# EAGLE design eeZee555 (EAGLE 6.4)
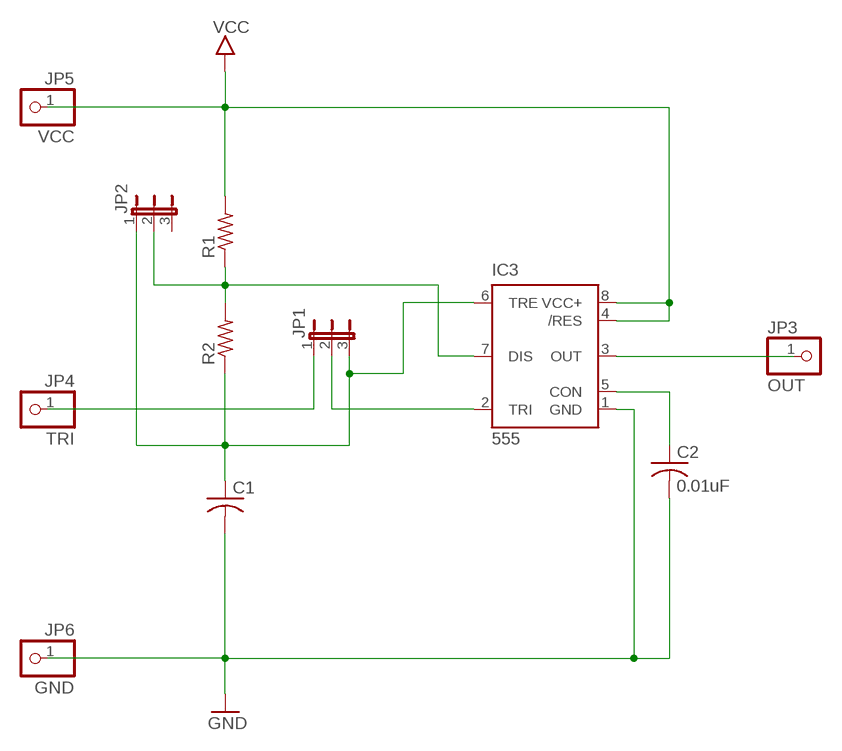
[diagram p0: schematic, sheet 1]

## Parts
C1  C-US050-025X075  [C050-025X075]
C2  0.01uF  C-USC0603  [C0603]
IC3  555  NE555P  [DIL-08]
JP1  JP2E  [JP2]
JP2  JP2E  [JP2]
JP3  OUT  PINHD-1X01_2.54-S  [1X01-S]
JP4  TRI  PINHD-1X01_2.54-S  [1X01-S]
JP5  VCC  PINHD-1X01_2.54-S  [1X01-S]
JP6  GND  PINHD-1X01_2.54-S  [1X01-S]
R1  R-US_0204/5  [0204/5]
R2  R-US_0204/5  [0204/5]

## Nets
GND: C1.2 C2.2 IC3.1(GND) JP6.1
N$15: IC3.7(DIS) JP2.2 R1.1 R2.2
N$16: C1.1 IC3.6(TRE) JP1.3 JP2.1 R2.1
N$17: JP1.1 JP4.1
N$18: IC3.2(TRI) JP1.2
N$19: IC3.3(OUT) JP3.1
N$20: C2.1 IC3.5(CON)
VCC: IC3.4(/RES) IC3.8(VCC+) JP5.1 R1.2
Unconnected: JP2.3

## Library data of the parts
C1 C2 = rcl:C-US: CAPACITOR, American symbol
IC3 = SparkFun:NE555: General purpose bipolar Timer; MF: Arrow Electronics; MPN: NE555N; OC_FARNELL: 1467742; OC_NEWARK: 89K1486
JP1 JP2 = jumper:JP2E: JUMPER
JP3-JP6 = pinhead-2:PINHD-1X01: PIN HEADER
R1 R2 = rcl:R-US_: RESISTOR, American symbol

## Board
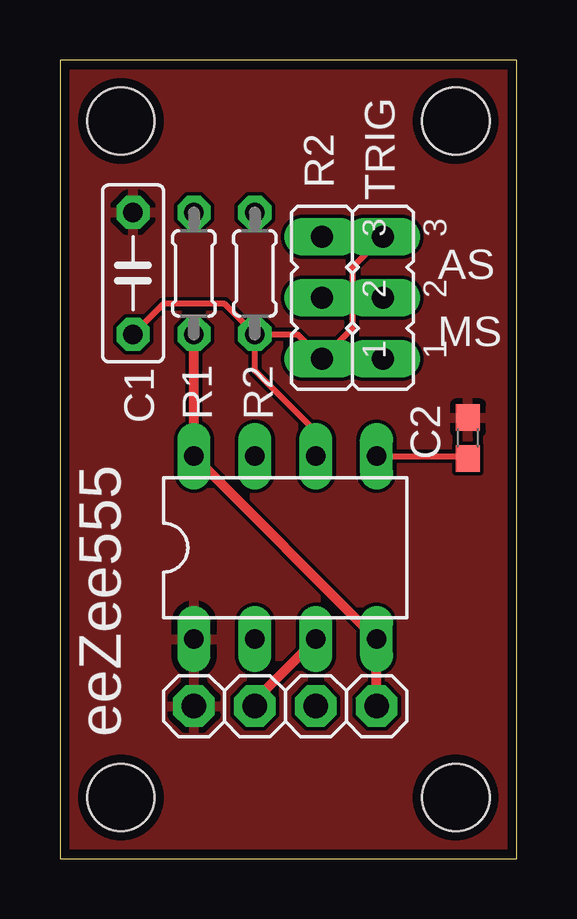
[diagram p1: board, top side]
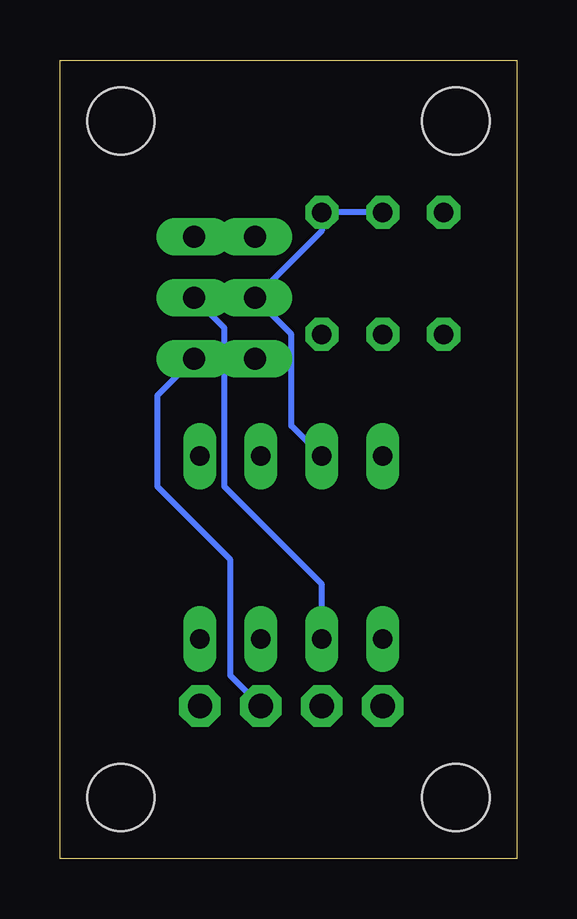
[diagram p2: board, bottom side, seen from below]

Size 19.05 x 33.27 mm. Coordinates in mm from the lower left corner, seen from the top.
Outline: 0,0 19.05,0 19.05,33.27 0,33.27 0,0
Copper layers (1*16): Top 0.0356mm / dielectric 1.5011mm / Bottom 0.0356mm
Design rules "LaenPCBOrder *": minimum track width 6mil, minimum drill 13mil, track to track 6mil, track to pad 6mil, pad to pad 6mil, via to via 6mil, smd to smd 6mil, copper to edge 15mil, drill to drill 6mil, minimum pad ring 7mil, minimum via ring 7mil, stop-mask expansion 4mil, vias tented up to drill 20mil, thermal gap 10mil
Holes 2.8 mm at 2.54,2.54 16.51,2.54 16.51,30.73 2.54,30.73

### Footprints (pad centres in the part's own frame; a part is rotated, then mirrored left to right if it is on the bottom)
C050-025X075 = drill 0.813 octagon: 1 -2.54,0; 2 2.54,0
C0603 = smd 1.1 x 1: 1 -0.85,0; 2 0.85,0
DIL-08 = drill 0.813 long: 1 -3.81,-3.81; 2 -1.27,-3.81; 3 1.27,-3.81; 4 3.81,-3.81; 5 3.81,3.81; 6 1.27,3.81; 7 -1.27,3.81; 8 -3.81,3.81
JP2 = drill 0.914 long: 1 -2.54,0; 2 0,0; 3 2.54,0
1X01-S = drill 1.016 octagon: 1 0,0
0204/5 = drill 0.813 octagon: 1 -2.54,0; 2 2.54,0

### Placement (x,y rotation side)
C1  3.05,24.38 90 top
C2  17.02,17.53 90 top
IC3  9.4,12.95 0 top
JP1  13.46,23.37 90 top
JP2  10.92,23.37 90 top
JP3  8.13,6.35 0 top
JP4  10.67,6.35 0 top
JP5  13.21,6.35 0 top
JP6  5.59,6.35 0 top
R1  5.59,24.38 270 top
R2  8.13,24.38 90 top

### Tracks (layer width: path | path; a pad name or v marks a point on that pad's centre or on a via)
GND
  pour Top: 0,0 0,33.27 19.05,33.27 19.05,0
N$15
  Bottom 0.254: IC3.7 9.4,18.03 9.4,21.84 JP2.2 8.13,26.16 R2.2 R1.1
N$16
  Top 0.254: IC3.6 10.67,17.78 8.13,20.32 R2.1 | R2.1 9.91,21.84 JP2.1 12.19,22.1 12.19,24.64 JP1.3 | R2.1 6.86,23.11 4.32,23.11 C1.1
N$17
  Bottom 0.254: JP4.1 11.94,7.62 11.94,12.45 14.99,15.49 14.99,19.3 JP1.1
N$18
  Bottom 0.254: IC3.2 8.13,11.43 12.19,15.49 12.19,22.1 JP1.2
N$19
  Top 0.406: JP3.1 8.13,6.6 IC3.3
N$20
  Top 0.254: IC3.5 16.85,16.76 C2.1
VCC
  Top 0.406: JP5.1 IC3.4 IC3.8 R1.2

### Text on the board
tNames: R2 | TRIG | AS | MS | eeZee555